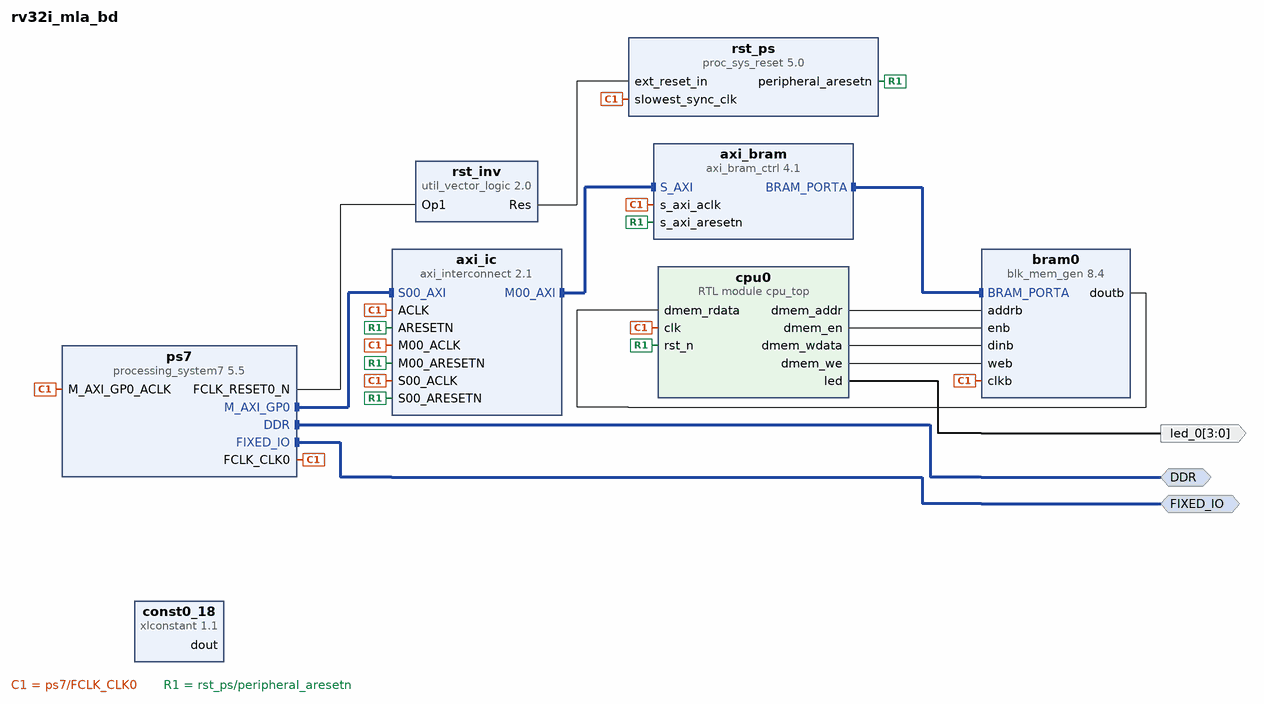
[diagram p0: block diagram of the top level]
# Vivado block design rv32i_mla_bd, xc7z020clg400-1, Vivado 2022.2
create_bd_design rv32i_mla_bd

create_bd_intf_port -mode Master -vlnv xilinx.com:interface:ddrx_rtl:1.0 DDR
create_bd_intf_port -mode Master -vlnv xilinx.com:display_processing_system7:fixedio_rtl:1.0 FIXED_IO
create_bd_port -dir O -from 3 -to 0 led_0

create_bd_cell -type ip -vlnv xilinx.com:ip:processing_system7:5.5 ps7
# 33 more settings of ps7 are not shown: defaults, MIO pin electricals, DDR timing, and values the tool derives
create_bd_cell -type ip -vlnv xilinx.com:ip:axi_interconnect:2.1 axi_ic
set_property -dict {CONFIG.NUM_MI 1} [get_bd_cells axi_ic]
create_bd_cell -type ip -vlnv xilinx.com:ip:axi_bram_ctrl:4.1 axi_bram
set_property -dict [list \
  CONFIG.DATA_WIDTH 32 \
  CONFIG.PROTOCOL AXI4 \
  CONFIG.READ_LATENCY 1 \
  CONFIG.SINGLE_PORT_BRAM 1 \
] [get_bd_cells axi_bram]
create_bd_cell -type ip -vlnv xilinx.com:ip:blk_mem_gen:8.4 bram0
set_property -dict [list \
  CONFIG.Enable_B Use_ENB_Pin \
  CONFIG.Memory_Type True_Dual_Port_RAM \
  CONFIG.Read_Width_A 32 \
  CONFIG.Read_Width_B 32 \
  CONFIG.Write_Width_A 32 \
  CONFIG.Write_Width_B 32 \
  CONFIG.use_bram_block BRAM_Controller \
] [get_bd_cells bram0]
create_bd_cell -type ip -vlnv xilinx.com:ip:util_vector_logic:2.0 rst_inv
set_property -dict {CONFIG.C_OPERATION not CONFIG.C_SIZE 1} [get_bd_cells rst_inv]
create_bd_cell -type ip -vlnv xilinx.com:ip:proc_sys_reset:5.0 rst_ps
create_bd_cell -type ip -vlnv xilinx.com:ip:xlconstant:1.1 const0_18
set_property -dict {CONFIG.CONST_VAL 0 CONFIG.CONST_WIDTH 18} [get_bd_cells const0_18]
create_bd_cell -type module -reference cpu_top cpu0

# ---- connections ----

connect_bd_intf_net [get_bd_intf_pins axi_bram/BRAM_PORTA] [get_bd_intf_pins bram0/BRAM_PORTA]
connect_bd_intf_net [get_bd_intf_pins axi_ic/M00_AXI] [get_bd_intf_pins axi_bram/S_AXI]
connect_bd_intf_net [get_bd_intf_ports DDR] [get_bd_intf_pins ps7/DDR]
connect_bd_intf_net [get_bd_intf_ports FIXED_IO] [get_bd_intf_pins ps7/FIXED_IO]
connect_bd_intf_net [get_bd_intf_pins ps7/M_AXI_GP0] [get_bd_intf_pins axi_ic/S00_AXI]
connect_bd_net [get_bd_pins bram0/doutb] [get_bd_pins cpu0/dmem_rdata]
# net const0_18_dout has one end: const0_18/dout
connect_bd_net [get_bd_pins cpu0/dmem_addr] [get_bd_pins bram0/addrb]
connect_bd_net [get_bd_pins cpu0/dmem_en] [get_bd_pins bram0/enb]
connect_bd_net [get_bd_pins cpu0/dmem_wdata] [get_bd_pins bram0/dinb]
connect_bd_net [get_bd_pins cpu0/dmem_we] [get_bd_pins bram0/web]
connect_bd_net [get_bd_pins cpu0/led] [get_bd_ports led_0]
connect_bd_net [get_bd_pins ps7/FCLK_CLK0] \
  [get_bd_pins axi_ic/ACLK] [get_bd_pins axi_ic/S00_ACLK] [get_bd_pins axi_bram/s_axi_aclk] [get_bd_pins axi_ic/M00_ACLK] \
  [get_bd_pins ps7/M_AXI_GP0_ACLK] [get_bd_pins rst_ps/slowest_sync_clk] [get_bd_pins bram0/clkb] [get_bd_pins cpu0/clk]
connect_bd_net [get_bd_pins ps7/FCLK_RESET0_N] [get_bd_pins rst_inv/Op1]
connect_bd_net [get_bd_pins rst_inv/Res] [get_bd_pins rst_ps/ext_reset_in]
connect_bd_net [get_bd_pins rst_ps/peripheral_aresetn] \
  [get_bd_pins axi_ic/ARESETN] [get_bd_pins axi_ic/S00_ARESETN] [get_bd_pins axi_ic/M00_ARESETN] \
  [get_bd_pins axi_bram/s_axi_aresetn] [get_bd_pins cpu0/rst_n]
set_property HDL_ATTRIBUTE.BMM_INFO_PROCESSOR {arm > rv32i_mla_bd axi_bram} [get_bd_cells ps7]
set_property HDL_ATTRIBUTE.KEEP_HIERARCHY yes [get_bd_cells ps7]
set_property HDL_ATTRIBUTE.BMM_INFO_ADDRESS_SPACE {byte  0x40000000 32 > rv32i_mla_bd bram0} [get_bd_cells axi_bram]
set_property HDL_ATTRIBUTE.KEEP_HIERARCHY yes [get_bd_cells axi_bram]

# ---- address map ----
assign_bd_address -offset 0x40000000 -range 8K -target_address_space [get_bd_addr_spaces ps7/Data] [get_bd_addr_segs axi_bram/S_AXI/Mem0]

validate_bd_design
save_bd_design
